# Altium schematic sheet mower_bdc.SchDoc
size A4
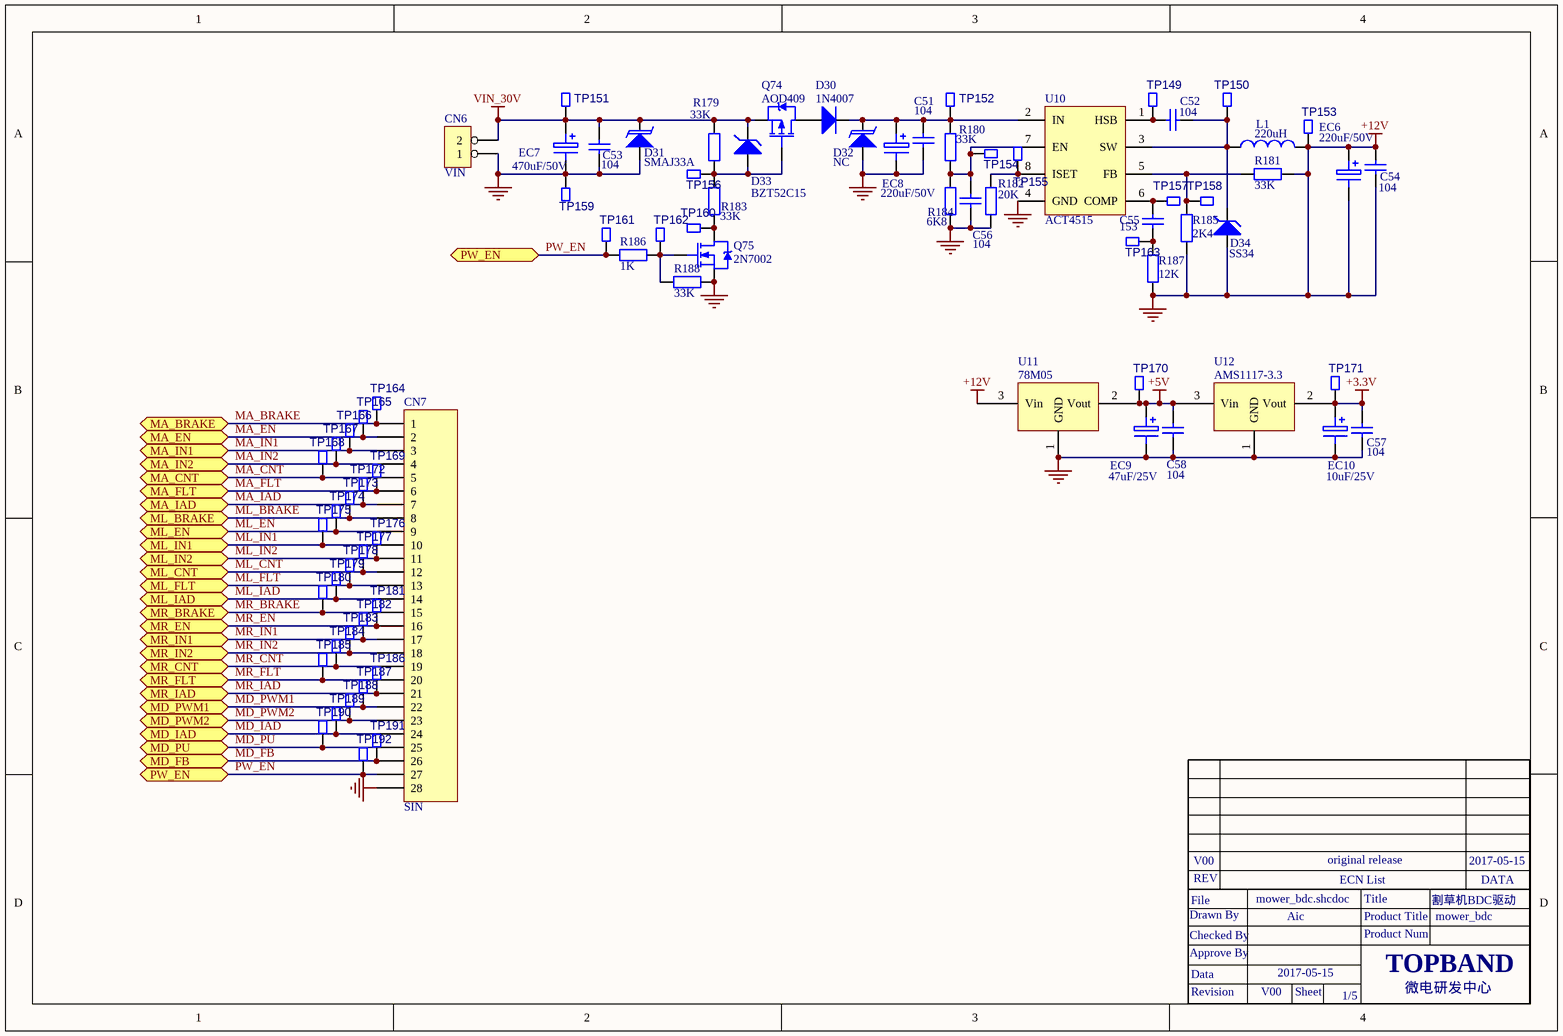
[diagram p0: mower_bdc.SchDoc]

## Parts
C51  104  [0603C]
C52  104  [0603C]
C53  104  [0805C]
C54  104  [0603C]
C55  153  [0603C]
C56  104  [0603C]
C57  104  [0603C]
C58  104  [0603C]
CN6  VIN  [CON2-3.96]
CN7  SIN  [CON2.54-2*14]
D30  1N4007  [SMA]
D31  SMAJ33A  [DO-214AC]
D32  NC  [SOD-123]
D33  BZT52C15  [SOD-123]
D34  SS34  [SMA]
EC6  220uF/50V  [EC10]
EC7  470uF/50V  [EC12.5]
EC8  220uF/50V  [EC10]
EC9  47uF/25V  [EC5]
EC10  10uF/25V  [EC4]
L1  220uH  [150700618]
Q74  AOD409  [D-PACK-GDS]
Q75  2N7002  [SOT23-GDS]
R179  33K  [0603R]
R180  33K  [0603R]
R181  33K  [0603R]
R182  20K  [0603R]
R183  33K  [0603R]
R184  6K8  [0603R]
R185  2K4  [0603R]
R186  1K  [0603R]
R187  12K  [0603R]
R188  33K  [0603R]
TP149  TP  [TEST-0.8MM]  (value not drawn)
TP150  TP  [TEST-0.8MM]  (value not drawn)
TP151  TP  [TEST-0.8MM]  (value not drawn)
TP152  TP  [TEST-0.8MM]  (value not drawn)
TP153  TP  [TEST-0.8MM]  (value not drawn)
TP154  TP  [TEST-0.8MM]  (value not drawn)
TP155  TP  [TEST-0.8MM]  (value not drawn)
TP156  TP  [TEST-0.8MM]  (value not drawn)
TP157  TP  [TEST-0.8MM]  (value not drawn)
TP158  TP  [TEST-0.8MM]  (value not drawn)
TP159  TP  [TEST-0.8MM]  (value not drawn)
TP160  TP  [TEST-0.8MM]  (value not drawn)
TP161  TP  [TEST-0.8MM]  (value not drawn)
TP162  TP  [TEST-0.8MM]  (value not drawn)
TP163  TP  [TEST-0.8MM]  (value not drawn)
TP164  TP  [TEST-0.8MM]  (value not drawn)
TP165  TP  [TEST-0.8MM]  (value not drawn)
TP166  TP  [TEST-0.8MM]  (value not drawn)
TP167  TP  [TEST-0.8MM]  (value not drawn)
TP168  TP  [TEST-0.8MM]  (value not drawn)
TP169  TP  [TEST-0.8MM]  (value not drawn)
TP170  TP  [TEST-0.8MM]  (value not drawn)
TP171  TP  [TEST-0.8MM]  (value not drawn)
TP172  TP  [TEST-0.8MM]  (value not drawn)
TP173  TP  [TEST-0.8MM]  (value not drawn)
TP174  TP  [TEST-0.8MM]  (value not drawn)
TP175  TP  [TEST-0.8MM]  (value not drawn)
TP176  TP  [TEST-0.8MM]  (value not drawn)
TP177  TP  [TEST-0.8MM]  (value not drawn)
TP178  TP  [TEST-0.8MM]  (value not drawn)
TP179  TP  [TEST-0.8MM]  (value not drawn)
TP180  TP  [TEST-0.8MM]  (value not drawn)
TP181  TP  [TEST-0.8MM]  (value not drawn)
TP182  TP  [TEST-0.8MM]  (value not drawn)
TP183  TP  [TEST-0.8MM]  (value not drawn)
TP184  TP  [TEST-0.8MM]  (value not drawn)
TP185  TP  [TEST-0.8MM]  (value not drawn)
TP186  TP  [TEST-0.8MM]  (value not drawn)
TP187  TP  [TEST-0.8MM]  (value not drawn)
TP188  TP  [TEST-0.8MM]  (value not drawn)
TP189  TP  [TEST-0.8MM]  (value not drawn)
TP190  TP  [TEST-0.8MM]  (value not drawn)
TP191  TP  [TEST-0.8MM]  (value not drawn)
TP192  TP  [TEST-0.8MM]  (value not drawn)
U10  ACT4515  [SOP-8]
U11  78M05  [D-PACK]
U12  AMS1117-3.3  [SOT-223]

## Ports
MA_BRAKE, MA_CNT, MA_EN, MA_FLT, MA_IAD, MA_IN1, MA_IN2, MD_FB, MD_IAD, MD_PU, MD_PWM1, MD_PWM2, ML_BRAKE, ML_CNT, ML_EN, ML_FLT, ML_IAD, ML_IN1, ML_IN2, MR_BRAKE, MR_CNT, MR_EN, MR_FLT, MR_IAD, MR_IN1, MR_IN2, PW_EN

## Nets
+3.3V: C57.1 EC10.1 TP171.1 U12.2(Vout)
+5V: C58.1 EC9.1 TP170.1 U11.2(Vout) U12.3(Vin)
+12V: C51.2 C53.1 C54.1 C54.2 C56.2 C57.2 C58.2 CN6.1 CN7.28 D31.A D32.A D34.A EC6.1 EC6.2 EC7.2 EC8.2 EC9.2 EC10.2 L1.2 Q75.S R181.1 R182.2 R184.2 R185.1 R187.1 R188.2 TP153.1 TP159.1 U10.4(GND) U11.1(GND) U11.3(Vin) U12.1(GND)  [also labelled GND]
VIN_30V: C53.2 CN6.2 D31.K D33.K EC7.1 Q74.S R179.2 TP151.1
MA_BRAKE: CN7.1 TP164.1 ; port MA_BRAKE
MA_CNT: CN7.5 TP168.1 ; port MA_CNT
MA_EN: CN7.2 TP165.1 ; port MA_EN
MA_FLT: CN7.6 TP169.1 ; port MA_FLT
MA_IAD: CN7.7 TP172.1 ; port MA_IAD
MA_IN1: CN7.3 TP166.1 ; port MA_IN1
MA_IN2: CN7.4 TP167.1 ; port MA_IN2
MD_FB: CN7.26 TP191.1 ; port MD_FB
MD_IAD: CN7.24 TP189.1 ; port MD_IAD
MD_PU: CN7.25 TP190.1 ; port MD_PU
MD_PWM1: CN7.22 TP187.1 ; port MD_PWM1
MD_PWM2: CN7.23 TP188.1 ; port MD_PWM2
ML_BRAKE: CN7.8 TP173.1 ; port ML_BRAKE
ML_CNT: CN7.12 TP177.1 ; port ML_CNT
ML_EN: CN7.9 TP174.1 ; port ML_EN
ML_FLT: CN7.13 TP178.1 ; port ML_FLT
ML_IAD: CN7.14 TP179.1 ; port ML_IAD
ML_IN1: CN7.10 TP175.1 ; port ML_IN1
ML_IN2: CN7.11 TP176.1 ; port ML_IN2
MR_BRAKE: CN7.15 TP180.1 ; port MR_BRAKE
MR_CNT: CN7.19 TP184.1 ; port MR_CNT
MR_EN: CN7.16 TP181.1 ; port MR_EN
MR_FLT: CN7.20 TP185.1 ; port MR_FLT
MR_IAD: CN7.21 TP186.1 ; port MR_IAD
MR_IN1: CN7.17 TP182.1 ; port MR_IN1
MR_IN2: CN7.18 TP183.1 ; port MR_IN2
PW_EN: CN7.27 R186.1 TP161.1 TP192.1 ; port PW_EN
NetC51_1: C51.1 D30.K D32.K EC8.1 R180.1 TP152.1 U10.2(IN)
NetC52_1: C52.1 TP149.1 U10.1(HSB)
NetC52_2: C52.2 D34.K L1.1 TP150.1 U10.3(SW)
NetC55_1: C55.1 TP157.1 U10.6(COMP)
NetC55_2: C55.2 R187.2 TP163.1
NetC56_1: C56.1 R180.2 R184.1 TP154.1 U10.7(EN)
NetD30_A: D30.A Q74.D
NetD33_A: D33.A Q74.G R179.1 R183.1 TP156.1
NetQ75_D: Q75.D R183.2 TP160.1
NetQ75_G: Q75.G R186.2 R188.1 TP162.1
NetR181_2: R181.2 R185.2 TP158.1 U10.5(FB)
NetR182_1: R182.1 TP155.1 U10.8(ISET)

## Notes on the sheet
- Drawn By
- File
- REV
- V00
- mower_bdc.shcdoc
- Aic
- original release
- ECN List
- Product Title
- Title
- 割草机BDC驱动
- mower_bdc
- 2017-05-15
- DATA
- Approve By
- Checked By
- Data
- Product Num
- TOPBAND
- Revision
- Sheet
- 1/5
- 微电研发中心

## Library data of the parts
C51-C58 = Cap(0603): Component Kind: standard; Component Type: standard
CN6 = 2Pin(卧式): 插座; U_TABLE: U_SAM01021601; id: 20; Part Number: 2Pin(卧式); Component Kind: Standard; Component Type: Standard; Designator: 2Pin(卧式); Footprint: CON2-2.54卧式; Pin Count: 2
CN7 = CON28
D30 = Diode(DO-35)-D: 二极管; U_TABLE: U_SAM010203; id: 32; Part Number: Diode(DO-35)-D; Component Kind: standard; Component Type: standard; Pin Count: 2
D31 = Diode(TVS_贴片)_1: 120301346; U_TABLE: U_SAM010203; id: 28; Description: TVS管; Part Number: Diode(TVS_贴片)_1; Component Kind: standard; Component Type: standard; Pin Count: 2
D32 = Diode(TVS_贴片)_1: TVS管; U_TABLE: U_SAM010203; id: 28; Part Number: Diode(TVS_贴片)_1; Component Kind: standard; Component Type: standard; Pin Count: 2
D33 D34 = D Zener(贴片): 120301465; U_TABLE: U_SAM010203; id: 25; Description: 稳压二极管; Part Number: D Zener(贴片); Component Kind: standard; Component Type: standard; Pin Count: 2
EC6 EC8-EC10 = Electro(2.5mm): 电解电容; U_TABLE: U_SAM010202; id: 42; Part Number: Electro(2.5mm); Component Kind: standard; Component Type: standard; Pin Count: 2
EC7 = Electro(2.5mm): 150200079; U_TABLE: U_SAM010202; id: 42; Description: 电解电容; Part Number: Electro(2.5mm); Component Kind: standard; Component Type: standard; Pin Count: 2
L1 = Inductor(0805): 150700618; U_TABLE: U_SAM010207; id: 140; Description: 电感; Part Number: Inductor(0805); Component Kind: standard; Component Type: standard
Q74 = PMOS-2: MOS管; U_TABLE: U_SAM010204; id: 19; Part Number: PMOS-2; Component Kind: standard; Component Type: standard; Pin Count: 3
Q75 = NMOS-2: MOS管; U_TABLE: U_SAM010204; id: 17; Part Number: NMOS-2; Component Kind: standard; Component Type: standard; Pin Count: 3
R179-R185 R187 R188 = Res2: Resistor; Value: 1K; 物料编码: 150103083; Published: 8-Jun-2000; LatestRevisionDate: 17-Jul-2002; LatestRevisionNote: Re-released for DXP Platform.; PackageReference: AXIAL-0.4; Publisher: Altium Limited
R186 = Res2: Resistor; 物料编码: 150103083; Published: 8-Jun-2000; LatestRevisionDate: 17-Jul-2002; LatestRevisionNote: Re-released for DXP Platform.; PackageReference: AXIAL-0.4; Publisher: Altium Limited; Value: 1K
U11 = AMS1117-3.3